# EAGLE schematic board (EAGLE 9.6.2)
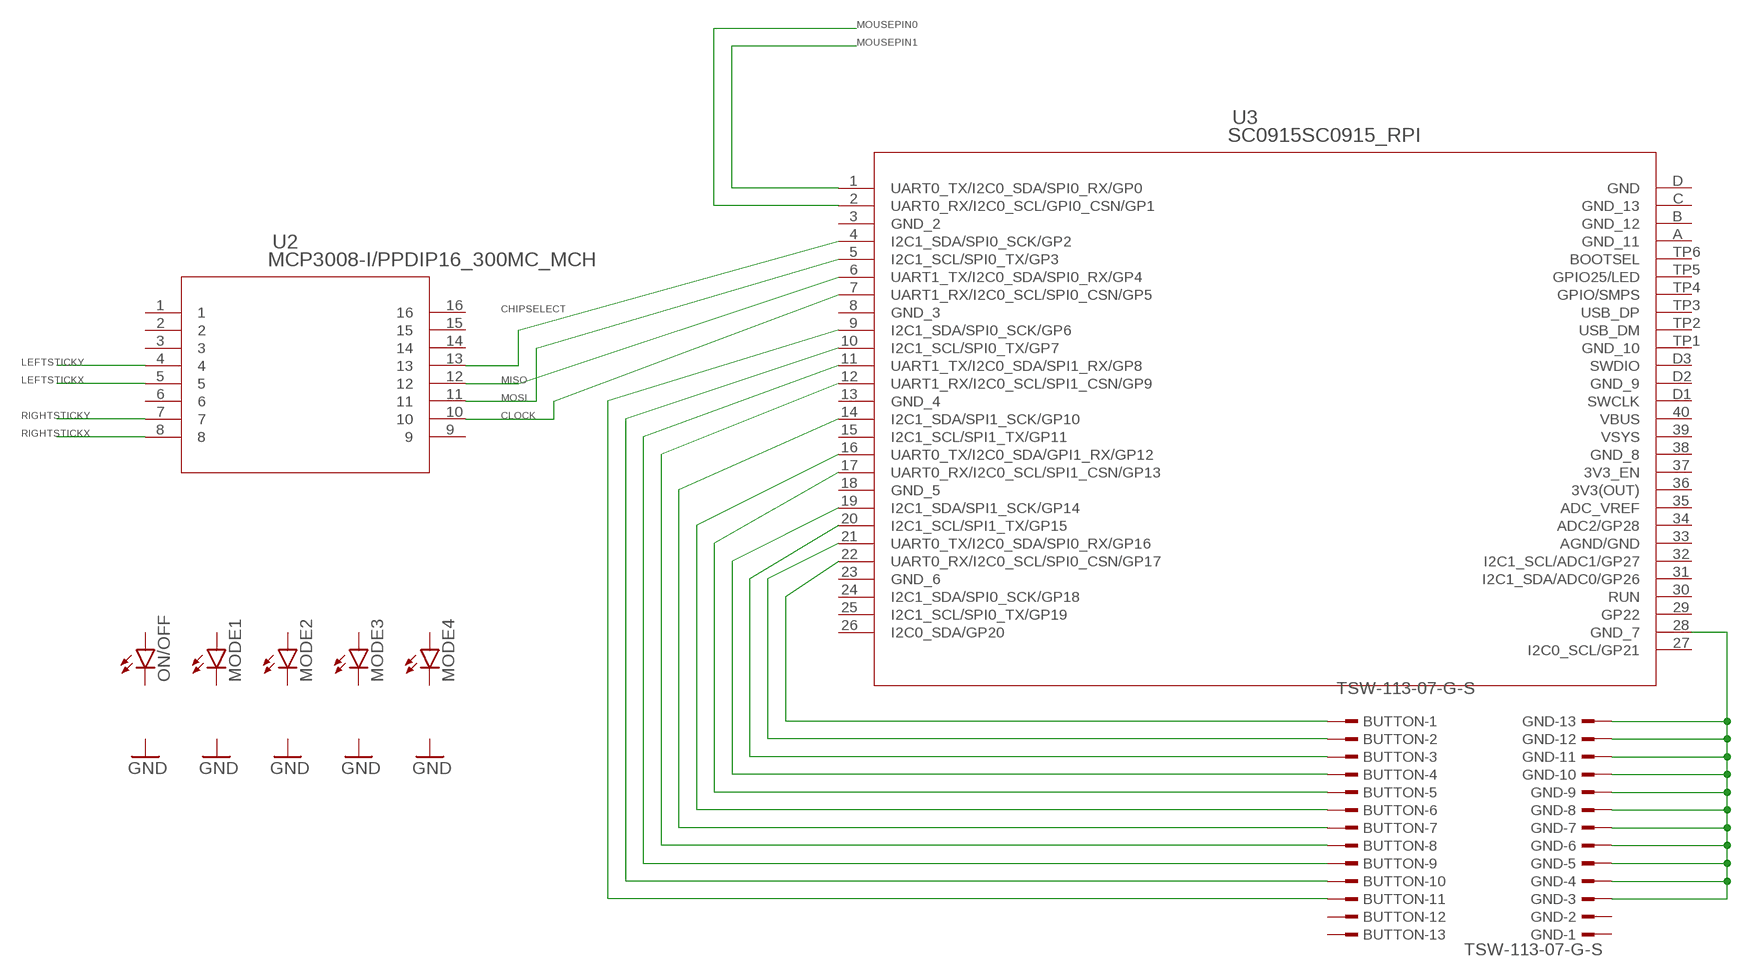
[diagram p0: schematic, sheet 1]

## Parts
BUTTON  TSW-113-07-G-S  [TSW-113-XX-G-S]
GND  TSW-113-07-G-S  [TSW-113-XX-G-S]
MODE1  LED5MM  [LED5MM]
MODE2  LED5MM  [LED5MM]
MODE3  LED5MM  [LED5MM]
MODE4  LED5MM  [LED5MM]
ON/OFF  LED5MM  [LED5MM]
U2  MCP3008-I/PPDIP16_300MC_MCH  [PDIP16_300MC_MCH]
U3  SC0915SC0915_RPI  [SC0915_RPI]

## Nets
CHIPSELECT: U2.13 U3.4(I2C1_SDA/SPI0_SCK/GP2)
CLOCK: U2.10 U3.7(UART1_RX/I2C0_SCL/SPI0_CSN/GP5)
GND: GND.3 GND.4 GND.5 GND.6 GND.7 GND.8 GND.9 GND.10 GND.11 GND.12 GND.13 U3.28(GND_7)
LEFTSTICKX: U2.5
LEFTSTICKY: U2.4
MISO: U2.12 U3.6(UART1_TX/I2C0_SDA/SPI0_RX/GP4)
MOSI: U2.11 U3.5(I2C1_SCL/SPI0_TX/GP3)
MOUSEPIN0: U3.2(UART0_RX/I2C0_SCL/GPI0_CSN/GP1)
MOUSEPIN1: U3.1(UART0_TX/I2C0_SDA/SPI0_RX/GP0)
N$9: BUTTON.11 U3.9(I2C1_SDA/SPI0_SCK/GP6)
N$10: BUTTON.10 U3.10(I2C1_SCL/SPI0_TX/GP7)
N$11: BUTTON.9 U3.11(UART1_TX/I2C0_SDA/SPI1_RX/GP8)
N$12: BUTTON.8 U3.12(UART1_RX/I2C0_SCL/SPI1_CSN/GP9)
N$13: BUTTON.7 U3.14(I2C1_SDA/SPI1_SCK/GP10)
N$14: BUTTON.6 U3.16(UART0_TX/I2C0_SDA/GPI1_RX/GP12)
N$15: BUTTON.5 U3.17(UART0_RX/I2C0_SCL/SPI1_CSN/GP13)
N$16: BUTTON.4 U3.19(I2C1_SDA/SPI1_SCK/GP14)
N$17: BUTTON.3 U3.20(I2C1_SCL/SPI1_TX/GP15)
N$18: BUTTON.2 U3.21(UART0_TX/I2C0_SDA/SPI0_RX/GP16)
N$19: BUTTON.1 U3.22(UART0_RX/I2C0_SCL/SPI0_CSN/GP17)
RIGHTSTICKX: U2.8
RIGHTSTICKY: U2.7
Unconnected: BUTTON.12 BUTTON.13 GND.1 GND.2 MODE1.A MODE1.K(C) MODE2.A MODE2.K(C) MODE3.A MODE3.K(C) MODE4.A MODE4.K(C) ON/OFF.A ON/OFF.K(C) U2.1 U2.2 U2.3 U2.6 U2.9 U2.14 U2.15 U2.16 U3.3(GND_2) U3.8(GND_3) U3.13(GND_4) U3.15(I2C1_SCL/SPI1_TX/GP11) U3.18(GND_5) U3.23(GND_6) U3.24(I2C1_SDA/SPI0_SCK/GP18) U3.25(I2C1_SCL/SPI0_TX/GP19) U3.26(I2C0_SDA/GP20) U3.27(I2C0_SCL/GP21) U3.29(GP22) U3.30(RUN) U3.31(I2C1_SDA/ADC0/GP26) U3.32(I2C1_SCL/ADC1/GP27) U3.33(AGND/GND) U3.34(ADC2/GP28) U3.36(3V3(OUT)) U3.38(GND_8) U3.A(GND_11) U3.B(GND_12) U3.C(GND_13) U3.D1(SWCLK) U3.D2(GND_9) U3.D3(SWDIO) U3.D(GND) U3.TP1(GND_10) U3.TP2(USB_DM) U3.TP3(USB_DP) U3.TP4(GPIO/SMPS) U3.TP5(GPIO25/LED) U3.TP6(BOOTSEL)

## Power pins joined to a net without a drawn wire
3V3_EN: U3.37(3V3_EN)
ADC_VREF: U3.35(ADC_VREF)
VBUS: U3.40(VBUS)
VSYS: U3.39(VSYS)

## Library data of the parts
BUTTON GND = con-samtec:TSW-113-*-G-S: THROUGH-HOLE .025" SQ POST HEADER Source: Samtec TSW.pdf; MF: Samtec Inc.; MPN: TSW-113-07-G-S
MODE1-MODE4 ON/OFF = led:LED: LED OSRAM: - CHIPLED LG R971, LG N971, LY N971, LG Q971, LY Q971, LO R971, LY R971 LH N974, LH R974 LS Q976, LO Q976, LY Q976 LO Q996 - Hyper CHIPLED LW Q18S LB Q993, LB Q99A, LB R99A - SideLED LS A670, LO A670, LY A670, LG A670, LP A670 LB A673, LV A673, LT A673, LW A673 LH A674 LY A675 LS A676, LA A676, LO A676, LY A676, LW A676 LS A679, LY A679, LG A679 - Hyper Micro SIDELED® LS Y876, LA Y876, LO Y876, LY Y876 LT Y87S - SmartLED LW L88C, LW L88S LB L89C, LB L89S, LG L890 LS L89K, LO L89K, LY L89K LS L896, LA L896, LO L896, LY L896 - TOPLED LS T670, LO T670, LY T670, LG T670, LP T670 LSG T670, LSP T670, LSY T670, LOP T670, LYG T670 LG T671, LOG T671, LSG T671 LB T673, LV T673, LT T673, LW T673 LH T674 LS T676, LA T676, LO T676, LY T676, LB T676, LH T676, LSB T676, LW T676 LB T67C, LV T67C, LT T67C, LS T67K, LO T67K, LY T67K, LW E67C LS E67B, LA E67B, LO E67B, LY E67B, LB E67C, LV E67C, LT E67C LW T67C LS T679, LY T679, LG T679 LS T770, LO T770, LY T770, LG T770, LP T770 LB T773, LV T773, LT T773, LW T773 LH T774 LS E675, LA E675, LY E675, LS T675 LS T776, LA T776, LO T776, LY T776, LB T776 LHGB T686 LT T68C, LB T68C - Hyper Mini TOPLED® LB M676 - Mini TOPLED Santana® LG M470 LS M47K, LO M47K, LY M47K Source: http://www.osram.convergy.de LUXEON: - LUMILED® LXK2-PW12-R00, LXK2-PW12-S00, LXK2-PW14-U00, LXK2-PW14-V00 LXK2-PM12-R00, LXK2-PM12-S00, LXK2-PM14-U00 LXK2-PE12-Q00, LXK2-PE12-R00, LXK2-PE12-S00, LXK2-PE14-T00, LXK2-PE14-U00 LXK2-PB12-K00, LXK2-PB12-L00, LXK2-PB12-M00, LXK2-PB14-N00, LXK2-PB14-P00, LXK2-PB14-Q00 LXK2-PR12-L00, LXK2-PR12-M00, LXK2-PR14-Q00, LXK2-PR14-R00 LXK2-PD12-Q00, LXK2-PD12-R00, LXK2-PD12-S00 LXK2-PH12-R00, LXK2-PH12-S00 LXK2-PL12-P00, LXK2-PL12-Q00, LXK2-PL12-R00 Source: www.luxeon.com KINGBRIGHT: KA-3528ASYC Source: www.kingbright.com
U2 = 2022-10-25_19-18-53_Library:MCP3008-I/P; COPYRIGHT: Copyright (C) 2022 Ultra Librarian. All rights reserved.; DIGI-KEY_PART_NUMBER_1: MCP3008-I/P-ND; MANUFACTURER_PART_NUMBER: MCP3008-I/P; MFR_NAME: Microchip
U3 = 2022-10-25_19-15-06_Library:SC0915; COPYRIGHT: Copyright (C) 2022 Ultra Librarian. All rights reserved.; MANUFACTURER_PART_NUMBER: SC0915; MFR_NAME: Raspberry Pi